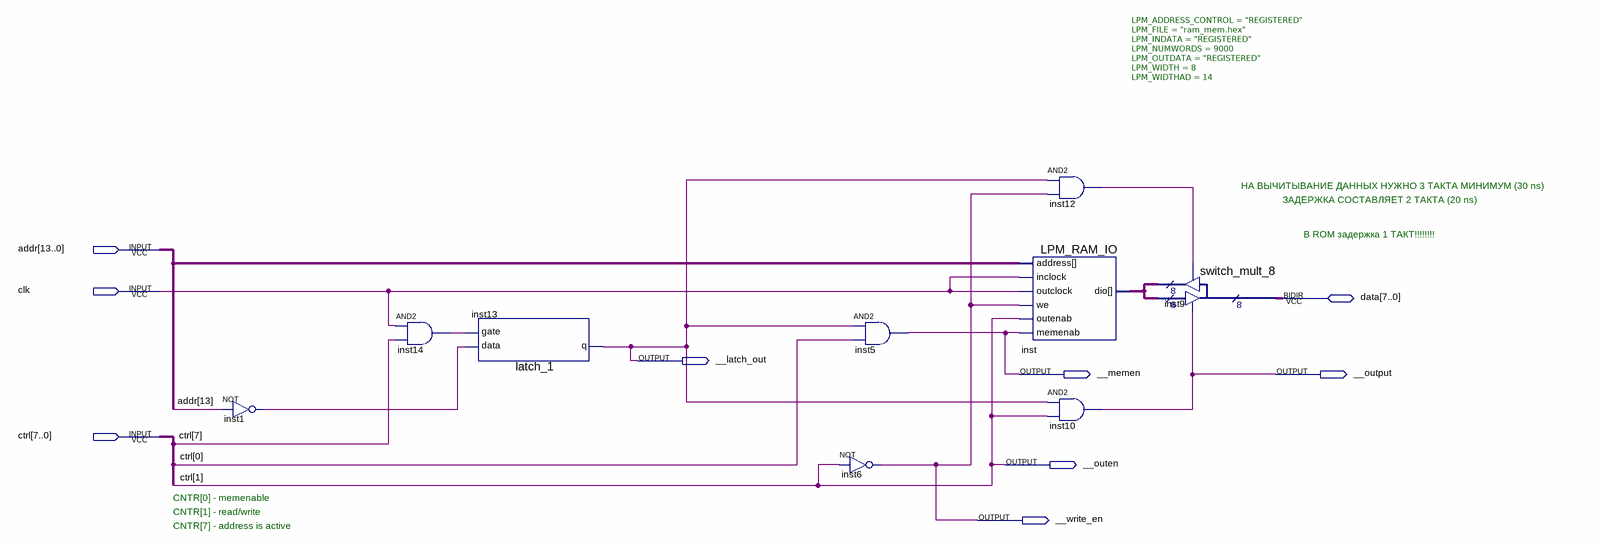
[diagram p0: schematic sheet]
// Quartus schematic ram.bdf as structural Verilog: 9 symbols, 9 pins
module ram (
  input  [13:0] addr,
  input  clk,
  input  [7:0] ctrl,
  inout  [7:0] data,
  output __latch_out,
  output __memen,
  output __output,
  output __outen,
  output __write_en
);

  wire inst1_out, inst12_out, inst14_out;
  wire [7:0] inst_dio;

  not inst1 (inst1_out, addr[13]);
  and inst14 (inst14_out, clk, ctrl[7]);
  latch_1 inst13 (.data(inst1_out), .gate(inst14_out), .q(__latch_out));
  not inst6 (__write_en, ctrl[1]);
  and inst5 (__memen, __latch_out, ctrl[0]);
  and inst12 (inst12_out, __latch_out, __write_en);
  LPM_RAM_IO #(.LPM_ADDRESS_CONTROL("REGISTERED"), .LPM_FILE("ram_mem.hex"), .LPM_INDATA("REGISTERED"), .LPM_NUMWORDS(9000), .LPM_OUTDATA("REGISTERED"), .LPM_WIDTH(8), .LPM_WIDTHAD(14)) inst (
    .address(addr), .outclock(clk), .memenab(__memen), .inclock(clk), .we(__write_en), .outenab(ctrl[1]),
    .dio(inst_dio));
  and inst10 (__output, __latch_out, ctrl[1]);
  switch_mult_8 inst9 (.enabledt(__output), .data(inst_dio), .enabletr(inst12_out), .result(inst_dio), .tridata(data));

  assign __outen = ctrl[1];

  // Notes on the sheet:
  //   НА ВЫЧИТЫВАНИЕ ДАННЫХ НУЖНО 3 ТАКТА МИНИМУМ (30 ns)
  //   ЗАДЕРЖКА СОСТАВЛЯЕТ 2 ТАКТА (20 ns)
  //   В ROM задержка 1 ТАКТ!!!!!!!!
  //   CNTR[0] - memenable
  //   CNTR[1] - read/write
  //   CNTR[7] - address is active
endmodule
